# EAGLE design discrete fan controller (EAGLE 6.5.0)
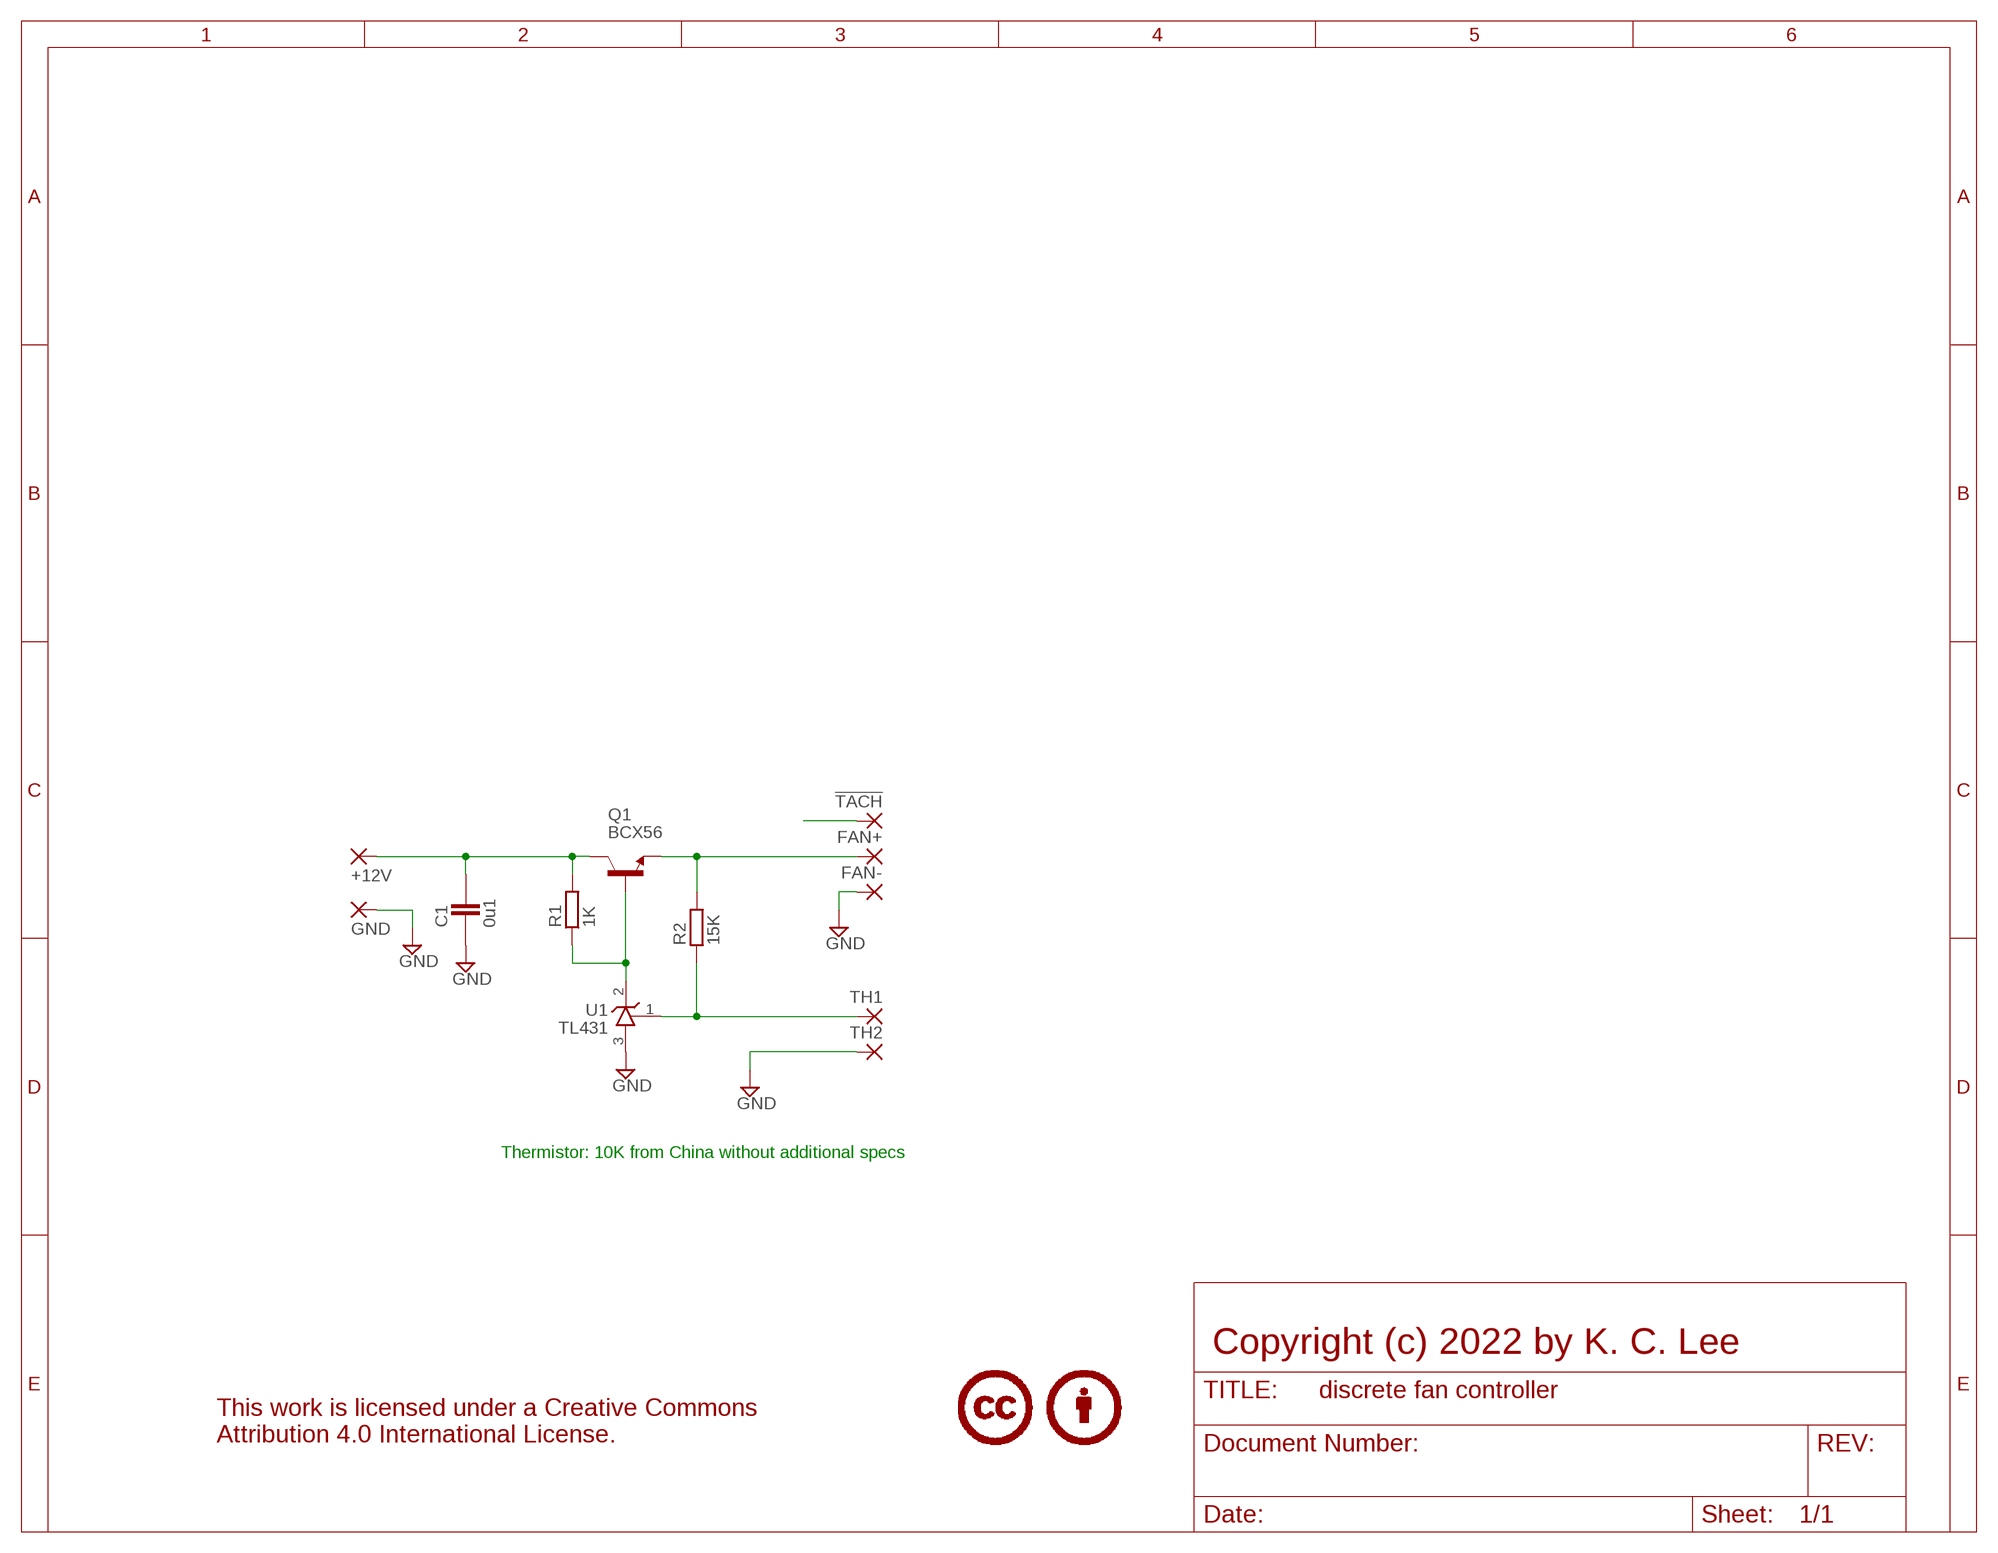
[diagram p0: schematic, sheet 1]

## Parts
!TACH  SMD2  [SMD1,27-2,54]
+12V  SMD2  [SMD1,27-2,54]
C1  0u1  CAPACITOR_0805  [CAPC2012X145AN]
FAN+  SMD2  [SMD1,27-2,54]
FAN-  SMD2  [SMD1,27-2,54]
GND  SMD2  [SMD1,27-2,54]
LICENSE1  CC-BY50%  [CC-BY-50]
Q1  BCX56  NPN_SOT89SOT89  [SOT89]
R1  1K  RESISTOR_0603  [RESC1608X55N]
R2  15K  RESISTOR_0603  [RESC1608X55N]
TH1  SMD2  [SMD1,27-2,54]
TH2  SMD2  [SMD1,27-2,54]
U1  TL431  TL_431DBZ  [SOT95P280X135-3N]

## Nets
!TACH: !TACH.1(P)
FAN+: FAN+.1(P) Q1.3(E) R2.2
GND: C1.1 FAN-.1(P) GND.1(P) TH2.1(P) U1.3(A)
N$3: Q1.1(B) R1.1 U1.2(C)
N$4: R2.1 TH1.1(P) U1.1(R)
VCC: +12V.1(P) C1.2 Q1.2(C) Q1.4(C) R1.2

## Notes on the sheet
- Thermistor: 10K from China without additional specs
- Copyright (c) 2022 by K. C. Lee

## Library data of the parts
!TACH +12V FAN+ FAN- GND TH1 TH2 = wirepad:SMD2: SMD PAD
C1 = ipc-7351-capacitor:CAPACITOR_
LICENSE1 = Misc logo:CC-BY
Q1 = ipc-7351-transistor:NPN_
R1 R2 = ipc-7351-resistor:RESISTOR_
U1 = Misc Analog:TL_431: Voltage Reference 1.24V TI TL431, ST3431

## Board
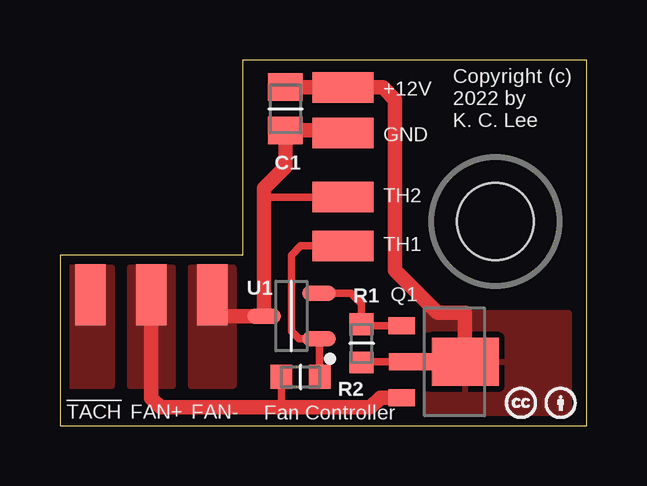
[diagram p1: board, top side]

Size 21.97 x 15.24 mm. Coordinates in mm from the lower left corner, seen from the top.
Outline: 0,0 21.97,0 21.97,15.24 7.62,15.24 7.62,7.11 0,7.11 0,0
Copper layers (1*16): Top 0.035559375mm / dielectric 1.6mm / Bottom 0.035559375mm
Design rules "oshpark-2layer-tented-vias": minimum track width 6mil, minimum drill 10mil, track to track 6mil, track to pad 6mil, pad to pad 6mil, via to via 6mil, smd to smd 6mil, copper to edge 15mil, drill to drill 6mil, minimum pad ring 5mil, minimum via ring 5mil, stop-mask expansion 2.5mil, vias tented up to drill 13mil, thermal gap 10mil
Holes 3.2 mm at 18.16,8.51

### Footprints (pad centres in the part's own frame; a part is rotated, then mirrored left to right if it is on the bottom)
SMD1,27-2,54 = smd 1.27 x 2.54: 1 0,0
CAPC2012X145AN = smd 1.15 x 1.45: 1 -0.9,0; 2 0.9,0
SOT89 = smd 0.7 x 1.1: 1 -1.5,-1.75; 3 1.5,-1.75 | smd 0.7 x 1.8: 2 0,-1.4 | smd 2 x 2.8: 4 0,0.9
RESC1608X55N = smd 0.9 x 1: 1 -0.8,0; 2 0.8,0
SOT95P280X135-3N = smd 1.4 x 0.65: 1 -1.15,0.95; 2 -1.15,-0.95; 3 1.15,0

### Placement (x,y rotation side)
!TACH  1.27,5.46 180 top
+12V  11.81,14.1 90 top
C1  9.4,13.21 90 top
FAN+  3.81,5.46 180 top
FAN-  6.35,5.46 180 top
GND  11.81,12.19 90 top
LICENSE1  18.54,0.25 0 top
Q1  16,2.67 270 top
R1  12.57,3.43 270 top
R2  10.03,2.03 180 top
TH1  11.81,7.49 90 top
TH2  11.81,9.53 270 top
U1  9.65,4.57 180 top

### Tracks (layer width: path | path; a pad name or v marks a point on that pad's centre or on a via)
!TACH
  pour Top (isolate 0.305, no thermals): 0.38,6.6 2.16,6.6 2.16,1.65 0.38,1.65
FAN+
  Top 0.305: R2.2 9.23,0.67 9.27,0.76
  Top 0.406: 12.74,0.8 12.95,0.76
  Top 0.61: Q1.3 13.36,1.17 12.95,0.76 9.27,0.76 4.19,0.76 3.81,1.14 FAN+.1
  pour Top (isolate 0.305, no thermals): 2.92,6.6 4.7,6.6 4.7,1.65 2.92,1.65
GND
  Top 0.305: TH2.1 8.5,9.53
  Top 0.61: GND.1 11.81,12.32 9.51,12.32 C1.1 9.4,10.8 8.5,9.91 8.5,9.53 U1.3 6.6,4.57 6.35,4.83 FAN-.1
  pour Top (no thermals): 5.46,6.6 7.24,6.6 7.24,1.65 5.46,1.65
N$3
  Top 0.305: Q1.1 12.64,4.17 R1.1 12.57,5.08 12.13,5.52 U1.2
N$4
  Top 0.305: TH1.1 10.03,7.49 9.65,7.11 9.65,3.94 9.97,3.62 U1.1 10.83,3.34 R2.1
VCC
  Top 0.305: Q1.2 12.61,2.67 R1.2
  Top 0.61: Q1.4 | Q1.4 Q1.2 | Q1.4 16.89,4.7 15.75,4.7 13.97,6.48 13.97,13.59 13.46,14.1 +12V.1 C1.2
  pour Top (isolate 0.406): 15.11,4.7 21.21,4.7 21.21,0.25 15.11,0.25

### Text on the board
tPlace: Copyright (c) / 2022 by / K. C. Lee | Fan Controller